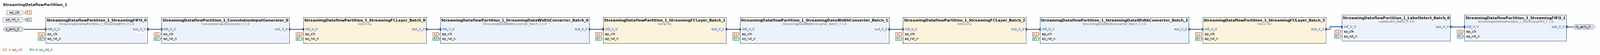
[diagram p0: block diagram of the top level, whole]
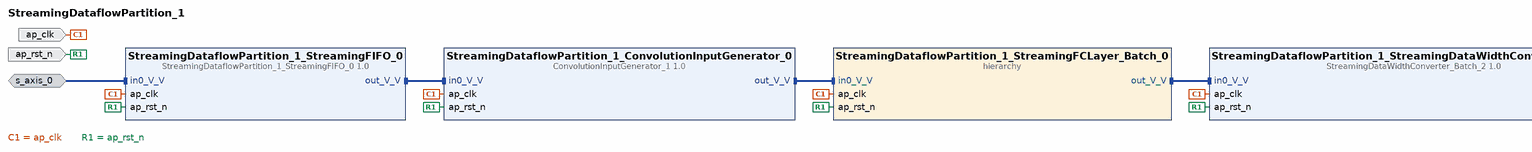
[diagram p1: block diagram of the top level, left part]
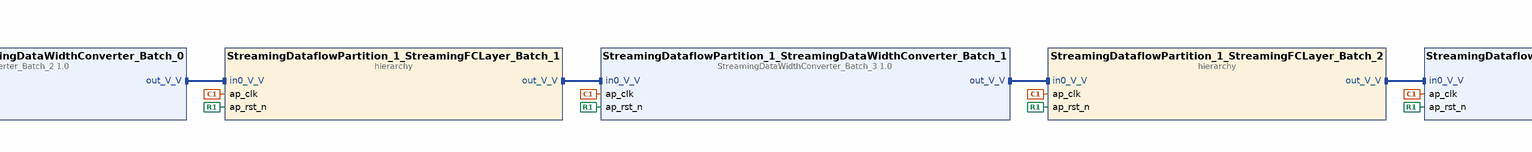
[diagram p2: block diagram of the top level, centre part]
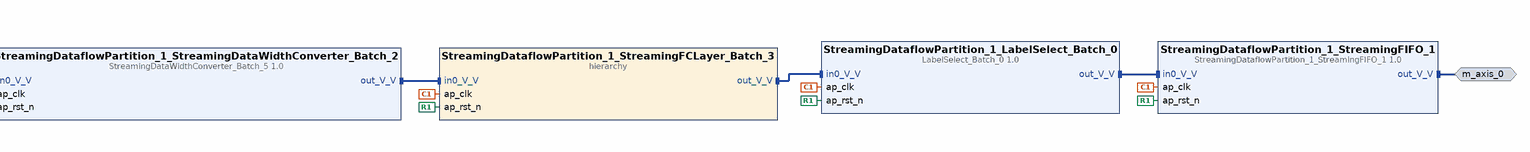
[diagram p3: block diagram of the top level, right part]
# Vivado block design StreamingDataflowPartition_1, xc7z020clg400-1, Vivado 2020.1.1
create_bd_design StreamingDataflowPartition_1

create_bd_intf_port -mode Slave -vlnv xilinx.com:interface:axis_rtl:1.0 s_axis_0
set_property -dict [list \
  CONFIG.TDATA_NUM_BYTES 2 \
  CONFIG.TDEST_WIDTH 0 \
  CONFIG.TID_WIDTH 0 \
  CONFIG.TUSER_WIDTH 0 \
  CONFIG.HAS_TREADY 1 \
  CONFIG.HAS_TSTRB 0 \
  CONFIG.HAS_TKEEP 0 \
  CONFIG.HAS_TLAST 0 \
  CONFIG.FREQ_HZ 100000000.000000 \
  CONFIG.LAYERED_METADATA undef \
] [get_bd_intf_ports s_axis_0]
create_bd_intf_port -mode Master -vlnv xilinx.com:interface:axis_rtl:1.0 m_axis_0
set_property -dict {CONFIG.FREQ_HZ 100000000.000000} [get_bd_intf_ports m_axis_0]
create_bd_port -dir I -type clk ap_clk
set_property -dict {CONFIG.FREQ_HZ 100000000.000000} [get_bd_ports ap_clk]
create_bd_port -dir I -type rst ap_rst_n

create_bd_cell -type ip -vlnv xilinx.com:hls:StreamingDataflowPartition_1_StreamingFIFO_0:1.0 StreamingDataflowPartition_1_StreamingFIFO_0
create_bd_cell -type ip -vlnv xilinx.com:hls:ConvolutionInputGenerator_1:1.0 StreamingDataflowPartition_1_ConvolutionInputGenerator_0
create_bd_cell -type hier StreamingDataflowPartition_1_StreamingFCLayer_Batch_0
create_bd_cell -type ip -vlnv xilinx.com:hls:StreamingDataWidthConverter_Batch_2:1.0 StreamingDataflowPartition_1_StreamingDataWidthConverter_Batch_0
create_bd_cell -type hier StreamingDataflowPartition_1_StreamingFCLayer_Batch_1
create_bd_cell -type ip -vlnv xilinx.com:hls:StreamingDataWidthConverter_Batch_3:1.0 StreamingDataflowPartition_1_StreamingDataWidthConverter_Batch_1
create_bd_cell -type hier StreamingDataflowPartition_1_StreamingFCLayer_Batch_2
create_bd_cell -type ip -vlnv xilinx.com:hls:StreamingDataWidthConverter_Batch_5:1.0 StreamingDataflowPartition_1_StreamingDataWidthConverter_Batch_2
create_bd_cell -type hier StreamingDataflowPartition_1_StreamingFCLayer_Batch_3
create_bd_cell -type ip -vlnv xilinx.com:hls:LabelSelect_Batch_0:1.0 StreamingDataflowPartition_1_LabelSelect_Batch_0
create_bd_cell -type ip -vlnv xilinx.com:hls:StreamingDataflowPartition_1_StreamingFIFO_1:1.0 StreamingDataflowPartition_1_StreamingFIFO_1

# ---- hierarchy /StreamingDataflowPartition_1_StreamingFCLayer_Batch_0 ----
current_bd_instance /StreamingDataflowPartition_1_StreamingFCLayer_Batch_0
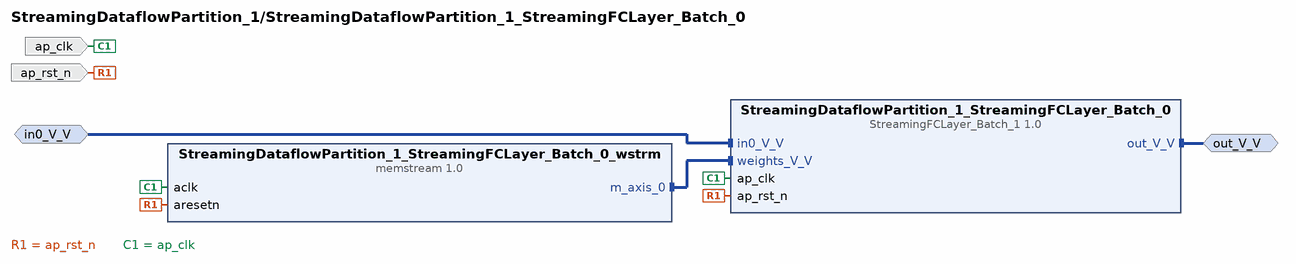
[diagram p4: block diagram inside /StreamingDataflowPartition_1_StreamingFCLayer_Batch_0]
create_bd_intf_pin -mode Master -vlnv xilinx.com:interface:axis_rtl:1.0 out_V_V
create_bd_intf_pin -mode Slave -vlnv xilinx.com:interface:axis_rtl:1.0 in0_V_V
create_bd_pin -dir I -type clk ap_clk
create_bd_pin -dir I -type rst ap_rst_n

create_bd_cell -type ip -vlnv xilinx.com:hls:StreamingFCLayer_Batch_1:1.0 StreamingDataflowPartition_1_StreamingFCLayer_Batch_0
create_bd_cell -type ip -vlnv xilinx.com:user:memstream:1.0 StreamingDataflowPartition_1_StreamingFCLayer_Batch_0_wstrm
set_property -dict [list \
  CONFIG.MEM_DEPTH 36864 \
  CONFIG.MEM_INIT /home/grgov/Diplomski_rad/finn_modified_docker_output_dir/code_gen_ipgen_StreamingFCLayer_Batch_1_0qzig8el/ \
  CONFIG.MEM_WIDTH 64 \
  CONFIG.NSTREAMS 1 \
  CONFIG.RAM_STYLE auto \
  CONFIG.STRM0_DEPTH 36864 \
  CONFIG.STRM0_OFFSET 0 \
  CONFIG.STRM0_WIDTH 64 \
] [get_bd_cells StreamingDataflowPartition_1_StreamingFCLayer_Batch_0_wstrm]

# ---- hierarchy /StreamingDataflowPartition_1_StreamingFCLayer_Batch_1 ----
current_bd_instance /StreamingDataflowPartition_1_StreamingFCLayer_Batch_1
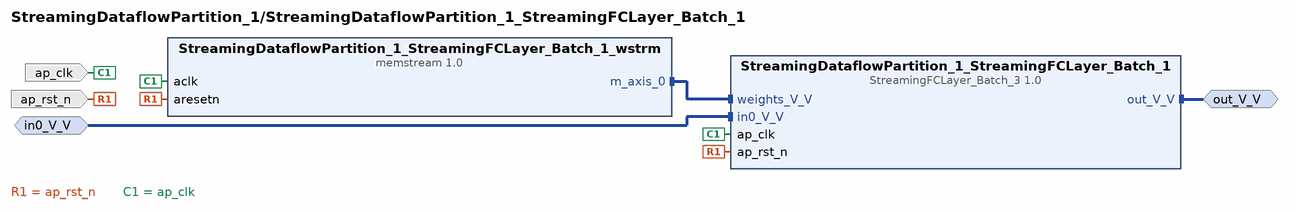
[diagram p5: block diagram inside /StreamingDataflowPartition_1_StreamingFCLayer_Batch_1]
create_bd_intf_pin -mode Master -vlnv xilinx.com:interface:axis_rtl:1.0 out_V_V
create_bd_intf_pin -mode Slave -vlnv xilinx.com:interface:axis_rtl:1.0 in0_V_V
create_bd_pin -dir I -type clk ap_clk
create_bd_pin -dir I -type rst ap_rst_n

create_bd_cell -type ip -vlnv xilinx.com:hls:StreamingFCLayer_Batch_3:1.0 StreamingDataflowPartition_1_StreamingFCLayer_Batch_1
create_bd_cell -type ip -vlnv xilinx.com:user:memstream:1.0 StreamingDataflowPartition_1_StreamingFCLayer_Batch_1_wstrm
set_property -dict [list \
  CONFIG.MEM_DEPTH 4096 \
  CONFIG.MEM_INIT /home/grgov/Diplomski_rad/finn_modified_docker_output_dir/code_gen_ipgen_StreamingFCLayer_Batch_3_svfl8kgq/ \
  CONFIG.MEM_WIDTH 128 \
  CONFIG.NSTREAMS 1 \
  CONFIG.RAM_STYLE block \
  CONFIG.STRM0_DEPTH 4096 \
  CONFIG.STRM0_OFFSET 0 \
  CONFIG.STRM0_WIDTH 128 \
] [get_bd_cells StreamingDataflowPartition_1_StreamingFCLayer_Batch_1_wstrm]

# ---- hierarchy /StreamingDataflowPartition_1_StreamingFCLayer_Batch_2 ----
current_bd_instance /StreamingDataflowPartition_1_StreamingFCLayer_Batch_2
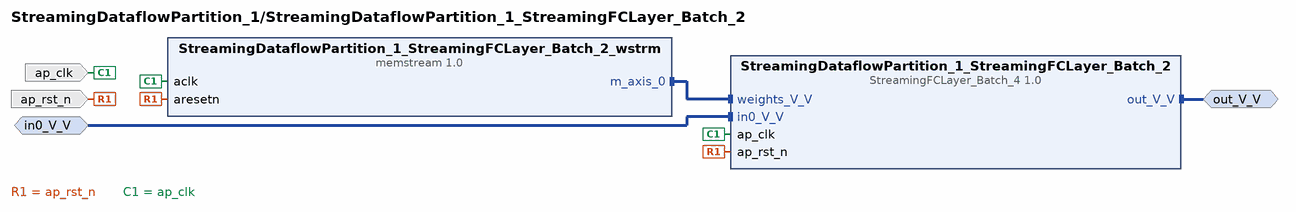
[diagram p6: block diagram inside /StreamingDataflowPartition_1_StreamingFCLayer_Batch_2]
create_bd_intf_pin -mode Master -vlnv xilinx.com:interface:axis_rtl:1.0 out_V_V
create_bd_intf_pin -mode Slave -vlnv xilinx.com:interface:axis_rtl:1.0 in0_V_V
create_bd_pin -dir I -type clk ap_clk
create_bd_pin -dir I -type rst ap_rst_n

create_bd_cell -type ip -vlnv xilinx.com:hls:StreamingFCLayer_Batch_4:1.0 StreamingDataflowPartition_1_StreamingFCLayer_Batch_2
create_bd_cell -type ip -vlnv xilinx.com:user:memstream:1.0 StreamingDataflowPartition_1_StreamingFCLayer_Batch_2_wstrm
set_property -dict [list \
  CONFIG.MEM_DEPTH 8192 \
  CONFIG.MEM_INIT /home/grgov/Diplomski_rad/finn_modified_docker_output_dir/code_gen_ipgen_StreamingFCLayer_Batch_4_r20yx0xx/ \
  CONFIG.MEM_WIDTH 128 \
  CONFIG.NSTREAMS 1 \
  CONFIG.RAM_STYLE auto \
  CONFIG.STRM0_DEPTH 8192 \
  CONFIG.STRM0_OFFSET 0 \
  CONFIG.STRM0_WIDTH 128 \
] [get_bd_cells StreamingDataflowPartition_1_StreamingFCLayer_Batch_2_wstrm]

# ---- hierarchy /StreamingDataflowPartition_1_StreamingFCLayer_Batch_3 ----
current_bd_instance /StreamingDataflowPartition_1_StreamingFCLayer_Batch_3
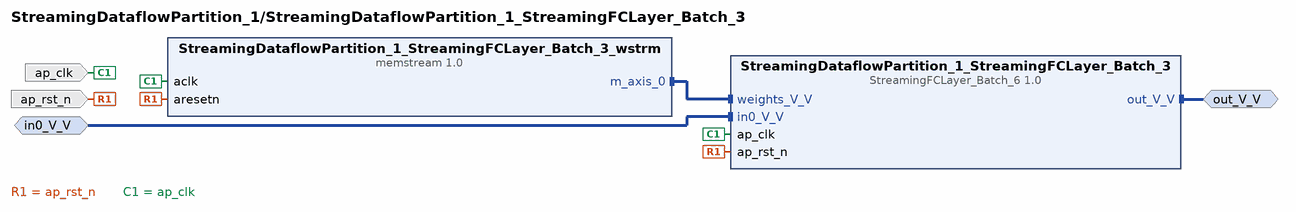
[diagram p7: block diagram inside /StreamingDataflowPartition_1_StreamingFCLayer_Batch_3]
create_bd_intf_pin -mode Master -vlnv xilinx.com:interface:axis_rtl:1.0 out_V_V
create_bd_intf_pin -mode Slave -vlnv xilinx.com:interface:axis_rtl:1.0 in0_V_V
create_bd_pin -dir I -type clk ap_clk
create_bd_pin -dir I -type rst ap_rst_n

create_bd_cell -type ip -vlnv xilinx.com:hls:StreamingFCLayer_Batch_6:1.0 StreamingDataflowPartition_1_StreamingFCLayer_Batch_3
create_bd_cell -type ip -vlnv xilinx.com:user:memstream:1.0 StreamingDataflowPartition_1_StreamingFCLayer_Batch_3_wstrm
set_property -dict [list \
  CONFIG.MEM_DEPTH 1792 \
  CONFIG.MEM_INIT /home/grgov/Diplomski_rad/finn_modified_docker_output_dir/code_gen_ipgen_StreamingFCLayer_Batch_6_emgw76in/ \
  CONFIG.MEM_WIDTH 8 \
  CONFIG.NSTREAMS 1 \
  CONFIG.RAM_STYLE distributed \
  CONFIG.STRM0_DEPTH 1792 \
  CONFIG.STRM0_OFFSET 0 \
  CONFIG.STRM0_WIDTH 8 \
] [get_bd_cells StreamingDataflowPartition_1_StreamingFCLayer_Batch_3_wstrm]

# ---- connections ----

current_bd_instance /StreamingDataflowPartition_1_StreamingFCLayer_Batch_0
connect_bd_intf_net [get_bd_intf_pins out_V_V] [get_bd_intf_pins StreamingDataflowPartition_1_StreamingFCLayer_Batch_0/out_V_V]
connect_bd_intf_net [get_bd_intf_pins in0_V_V] [get_bd_intf_pins StreamingDataflowPartition_1_StreamingFCLayer_Batch_0/in0_V_V]
connect_bd_intf_net [get_bd_intf_pins StreamingDataflowPartition_1_StreamingFCLayer_Batch_0_wstrm/m_axis_0] [get_bd_intf_pins StreamingDataflowPartition_1_StreamingFCLayer_Batch_0/weights_V_V]
connect_bd_net [get_bd_pins ap_rst_n] \
  [get_bd_pins StreamingDataflowPartition_1_StreamingFCLayer_Batch_0_wstrm/aresetn] \
  [get_bd_pins StreamingDataflowPartition_1_StreamingFCLayer_Batch_0/ap_rst_n]
connect_bd_net [get_bd_pins ap_clk] \
  [get_bd_pins StreamingDataflowPartition_1_StreamingFCLayer_Batch_0_wstrm/aclk] \
  [get_bd_pins StreamingDataflowPartition_1_StreamingFCLayer_Batch_0/ap_clk]

current_bd_instance /StreamingDataflowPartition_1_StreamingFCLayer_Batch_1
connect_bd_intf_net [get_bd_intf_pins StreamingDataflowPartition_1_StreamingFCLayer_Batch_1_wstrm/m_axis_0] [get_bd_intf_pins StreamingDataflowPartition_1_StreamingFCLayer_Batch_1/weights_V_V]
connect_bd_intf_net [get_bd_intf_pins in0_V_V] [get_bd_intf_pins StreamingDataflowPartition_1_StreamingFCLayer_Batch_1/in0_V_V]
connect_bd_intf_net [get_bd_intf_pins out_V_V] [get_bd_intf_pins StreamingDataflowPartition_1_StreamingFCLayer_Batch_1/out_V_V]
connect_bd_net [get_bd_pins ap_rst_n] \
  [get_bd_pins StreamingDataflowPartition_1_StreamingFCLayer_Batch_1_wstrm/aresetn] \
  [get_bd_pins StreamingDataflowPartition_1_StreamingFCLayer_Batch_1/ap_rst_n]
connect_bd_net [get_bd_pins ap_clk] \
  [get_bd_pins StreamingDataflowPartition_1_StreamingFCLayer_Batch_1_wstrm/aclk] \
  [get_bd_pins StreamingDataflowPartition_1_StreamingFCLayer_Batch_1/ap_clk]

current_bd_instance /StreamingDataflowPartition_1_StreamingFCLayer_Batch_2
connect_bd_intf_net [get_bd_intf_pins StreamingDataflowPartition_1_StreamingFCLayer_Batch_2_wstrm/m_axis_0] [get_bd_intf_pins StreamingDataflowPartition_1_StreamingFCLayer_Batch_2/weights_V_V]
connect_bd_intf_net [get_bd_intf_pins in0_V_V] [get_bd_intf_pins StreamingDataflowPartition_1_StreamingFCLayer_Batch_2/in0_V_V]
connect_bd_intf_net [get_bd_intf_pins out_V_V] [get_bd_intf_pins StreamingDataflowPartition_1_StreamingFCLayer_Batch_2/out_V_V]
connect_bd_net [get_bd_pins ap_rst_n] \
  [get_bd_pins StreamingDataflowPartition_1_StreamingFCLayer_Batch_2_wstrm/aresetn] \
  [get_bd_pins StreamingDataflowPartition_1_StreamingFCLayer_Batch_2/ap_rst_n]
connect_bd_net [get_bd_pins ap_clk] \
  [get_bd_pins StreamingDataflowPartition_1_StreamingFCLayer_Batch_2_wstrm/aclk] \
  [get_bd_pins StreamingDataflowPartition_1_StreamingFCLayer_Batch_2/ap_clk]

current_bd_instance /StreamingDataflowPartition_1_StreamingFCLayer_Batch_3
connect_bd_intf_net [get_bd_intf_pins StreamingDataflowPartition_1_StreamingFCLayer_Batch_3_wstrm/m_axis_0] [get_bd_intf_pins StreamingDataflowPartition_1_StreamingFCLayer_Batch_3/weights_V_V]
connect_bd_intf_net [get_bd_intf_pins in0_V_V] [get_bd_intf_pins StreamingDataflowPartition_1_StreamingFCLayer_Batch_3/in0_V_V]
connect_bd_intf_net [get_bd_intf_pins out_V_V] [get_bd_intf_pins StreamingDataflowPartition_1_StreamingFCLayer_Batch_3/out_V_V]
connect_bd_net [get_bd_pins ap_rst_n] \
  [get_bd_pins StreamingDataflowPartition_1_StreamingFCLayer_Batch_3_wstrm/aresetn] \
  [get_bd_pins StreamingDataflowPartition_1_StreamingFCLayer_Batch_3/ap_rst_n]
connect_bd_net [get_bd_pins ap_clk] \
  [get_bd_pins StreamingDataflowPartition_1_StreamingFCLayer_Batch_3_wstrm/aclk] \
  [get_bd_pins StreamingDataflowPartition_1_StreamingFCLayer_Batch_3/ap_clk]

current_bd_instance /
connect_bd_intf_net [get_bd_intf_pins StreamingDataflowPartition_1_StreamingFCLayer_Batch_2/out_V_V] [get_bd_intf_pins StreamingDataflowPartition_1_StreamingDataWidthConverter_Batch_2/in0_V_V]
connect_bd_intf_net [get_bd_intf_pins StreamingDataflowPartition_1_StreamingDataWidthConverter_Batch_2/out_V_V] [get_bd_intf_pins StreamingDataflowPartition_1_StreamingFCLayer_Batch_3/in0_V_V]
connect_bd_intf_net [get_bd_intf_pins StreamingDataflowPartition_1_StreamingFCLayer_Batch_3/out_V_V] [get_bd_intf_pins StreamingDataflowPartition_1_LabelSelect_Batch_0/in0_V_V]
connect_bd_intf_net [get_bd_intf_pins StreamingDataflowPartition_1_LabelSelect_Batch_0/out_V_V] [get_bd_intf_pins StreamingDataflowPartition_1_StreamingFIFO_1/in0_V_V]
connect_bd_intf_net [get_bd_intf_ports m_axis_0] [get_bd_intf_pins StreamingDataflowPartition_1_StreamingFIFO_1/out_V_V]
connect_bd_intf_net -intf_net in0_V_V_0_1 [get_bd_intf_ports s_axis_0] [get_bd_intf_pins StreamingDataflowPartition_1_StreamingFIFO_0/in0_V_V]
connect_bd_intf_net [get_bd_intf_pins StreamingDataflowPartition_1_StreamingFIFO_0/out_V_V] [get_bd_intf_pins StreamingDataflowPartition_1_ConvolutionInputGenerator_0/in0_V_V]
connect_bd_intf_net [get_bd_intf_pins StreamingDataflowPartition_1_ConvolutionInputGenerator_0/out_V_V] [get_bd_intf_pins StreamingDataflowPartition_1_StreamingFCLayer_Batch_0/in0_V_V]
connect_bd_intf_net [get_bd_intf_pins StreamingDataflowPartition_1_StreamingFCLayer_Batch_0/out_V_V] [get_bd_intf_pins StreamingDataflowPartition_1_StreamingDataWidthConverter_Batch_0/in0_V_V]
connect_bd_intf_net [get_bd_intf_pins StreamingDataflowPartition_1_StreamingDataWidthConverter_Batch_0/out_V_V] [get_bd_intf_pins StreamingDataflowPartition_1_StreamingFCLayer_Batch_1/in0_V_V]
connect_bd_intf_net [get_bd_intf_pins StreamingDataflowPartition_1_StreamingFCLayer_Batch_1/out_V_V] [get_bd_intf_pins StreamingDataflowPartition_1_StreamingDataWidthConverter_Batch_1/in0_V_V]
connect_bd_intf_net [get_bd_intf_pins StreamingDataflowPartition_1_StreamingDataWidthConverter_Batch_1/out_V_V] [get_bd_intf_pins StreamingDataflowPartition_1_StreamingFCLayer_Batch_2/in0_V_V]
connect_bd_net -net ap_clk_0_1 [get_bd_ports ap_clk] \
  [get_bd_pins StreamingDataflowPartition_1_StreamingFIFO_0/ap_clk] \
  [get_bd_pins StreamingDataflowPartition_1_ConvolutionInputGenerator_0/ap_clk] \
  [get_bd_pins StreamingDataflowPartition_1_StreamingFCLayer_Batch_0/ap_clk] \
  [get_bd_pins StreamingDataflowPartition_1_StreamingDataWidthConverter_Batch_0/ap_clk] \
  [get_bd_pins StreamingDataflowPartition_1_StreamingFCLayer_Batch_1/ap_clk] \
  [get_bd_pins StreamingDataflowPartition_1_StreamingDataWidthConverter_Batch_1/ap_clk] \
  [get_bd_pins StreamingDataflowPartition_1_StreamingFCLayer_Batch_2/ap_clk] \
  [get_bd_pins StreamingDataflowPartition_1_StreamingDataWidthConverter_Batch_2/ap_clk] \
  [get_bd_pins StreamingDataflowPartition_1_StreamingFCLayer_Batch_3/ap_clk] \
  [get_bd_pins StreamingDataflowPartition_1_LabelSelect_Batch_0/ap_clk] \
  [get_bd_pins StreamingDataflowPartition_1_StreamingFIFO_1/ap_clk]
connect_bd_net -net ap_rst_n_0_1 [get_bd_ports ap_rst_n] \
  [get_bd_pins StreamingDataflowPartition_1_StreamingFIFO_0/ap_rst_n] \
  [get_bd_pins StreamingDataflowPartition_1_ConvolutionInputGenerator_0/ap_rst_n] \
  [get_bd_pins StreamingDataflowPartition_1_StreamingFCLayer_Batch_0/ap_rst_n] \
  [get_bd_pins StreamingDataflowPartition_1_StreamingDataWidthConverter_Batch_0/ap_rst_n] \
  [get_bd_pins StreamingDataflowPartition_1_StreamingFCLayer_Batch_1/ap_rst_n] \
  [get_bd_pins StreamingDataflowPartition_1_StreamingDataWidthConverter_Batch_1/ap_rst_n] \
  [get_bd_pins StreamingDataflowPartition_1_StreamingFCLayer_Batch_2/ap_rst_n] \
  [get_bd_pins StreamingDataflowPartition_1_StreamingDataWidthConverter_Batch_2/ap_rst_n] \
  [get_bd_pins StreamingDataflowPartition_1_StreamingFCLayer_Batch_3/ap_rst_n] \
  [get_bd_pins StreamingDataflowPartition_1_LabelSelect_Batch_0/ap_rst_n] \
  [get_bd_pins StreamingDataflowPartition_1_StreamingFIFO_1/ap_rst_n]

validate_bd_design
save_bd_design
